# Altium schematic sheet NAP_CODE.SchDoc
size A4; SheetNumber: 2; SheetTotal: 2
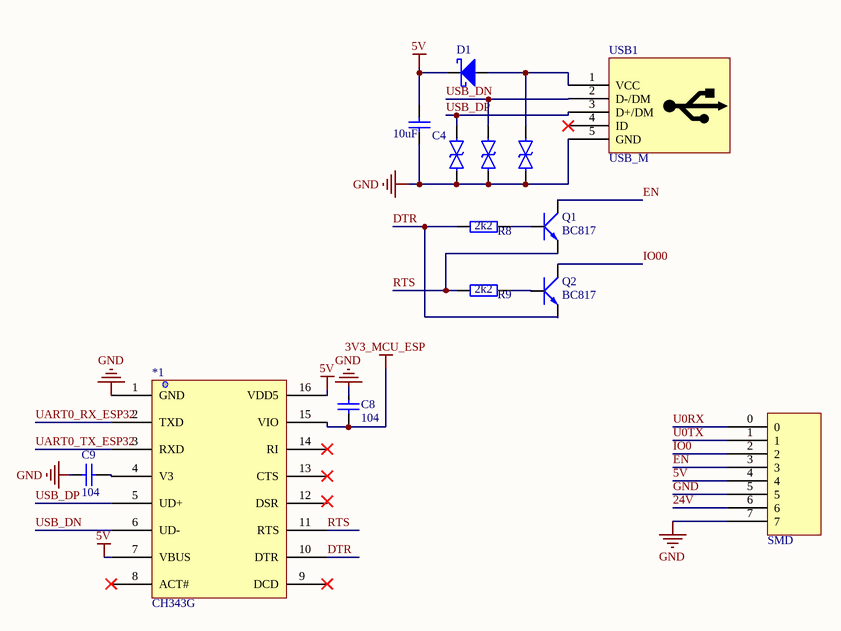
[diagram p0: NAP_CODE.SchDoc]

## Parts
*1  CH343G  [CH343G]
*?  SMD  [PCBComponent_1]  (part B of 2)
C4  10uF  [1206_CAP]
C8  104  [0603_Cap]
C9  104  [0603_Cap]
D1  SS24  [DIO-SMD-106]  (value not drawn)
Q1  BC817  [SOT-23]
Q2  BC817  [SOT-23]
R8  2k2  [0603_Res]
R9  2k2  [0603_Res]
TVS1  SMBJ12CA  [SMB - DO-214AA]  (value not drawn)
TVS2  SMBJ12CA  [SMB - DO-214AA]  (value not drawn)
TVS3  SMBJ12CA  [SMB - DO-214AA]  (value not drawn)
USB1  USB_M  [USB-M1]

## Nets
3V3_MCU_ESP: *1.15(VIO) C8.1
5V: *1.7(VBUS) *1.16(VDD5) *?.4 C4.1 D1.2
GND: *1.1(GND) *?.5 *?.7 C4.2 C8.2 C9.1 TVS1.1 TVS2.1 TVS3.1 USB1.5(GND)
24V: *?.6
DTR: *1.10(DTR) Q2.2(E) R8.1
EN: *?.3 Q1.3(C)
IO00: Q2.3(C)
IO0: *?.2
RTS: *1.11(RTS) Q1.2(E) R9.1
U0RX: *?.0
U0TX: *?.1
UART0_RX_ESP32: *1.2(TXD)
UART0_TX_ESP32: *1.3(RXD)
USB_DN: *1.6(UD-) TVS2.2 USB1.2(D-/DM)
USB_DP: *1.5(UD+) TVS1.2 USB1.3(D+/DM)
Net*1_4: *1.4(V3) C9.2
NetD1_1: D1.1 TVS3.2 USB1.1(VCC)
NetQ1_1: Q1.1(B) R8.2
NetQ2_1: Q2.1(B) R9.2

Not connected (* = marked no-connect by the designer): *1 8(ACT#)* 9(DCD)* 12(DSR) 13(CTS)* 14(RI)*; USB1 4(ID)*

## Library data of the parts
*? = Component_1
C4 C8 C9 = Ceramic Capacitor: Chung_Loai: Dán; Don_Vi: Con; So_Chan: 2; Ten_Linh_Kien: Tụ 0805 104-100nF 10% 50V; Ma_Hang: MH004551; Kieu_Chan: *
D1 = Diode Schottky: Part Number: LED 3 ly Single Colour; Pricing: *
Q1 Q2 = Trans BC817: SOT-23 - C8658; Value: C9014
R8 R9 = Resistor: Chung_Loai: Dán; Don_Vi: Con; So_Chan: 2; Ten_Linh_Kien: Trở 0805 1% 1k; Ma_Hang: MH005468; Kieu_Chan: *
TVS1-TVS3 = TVS Bi Diode